# Altium schematic sheet ADC5G_DIGITALIO.SchDoc: FMC 5GS/s ADC/TDC
size 420 x 297 mm; Author: Agnieszka Bartkowicz; CompanyName: WUT ISE; DrawnBy: Agnieszka Bartkowicz; Engineer: Agnieszka Bartkowicz; Organization: WUT ISE; Address1: PW ISE; Address2: Nowowiejska 15/19 00-665 Warsaw; Address3: gyorka@o2.pl; SheetNumber: 4; SheetTotal: 13; ModifiedBy: -; CheckedDate: -; Title2: Title 2; DivGrp: WUT ISE; Designer: A. Bartkowicz
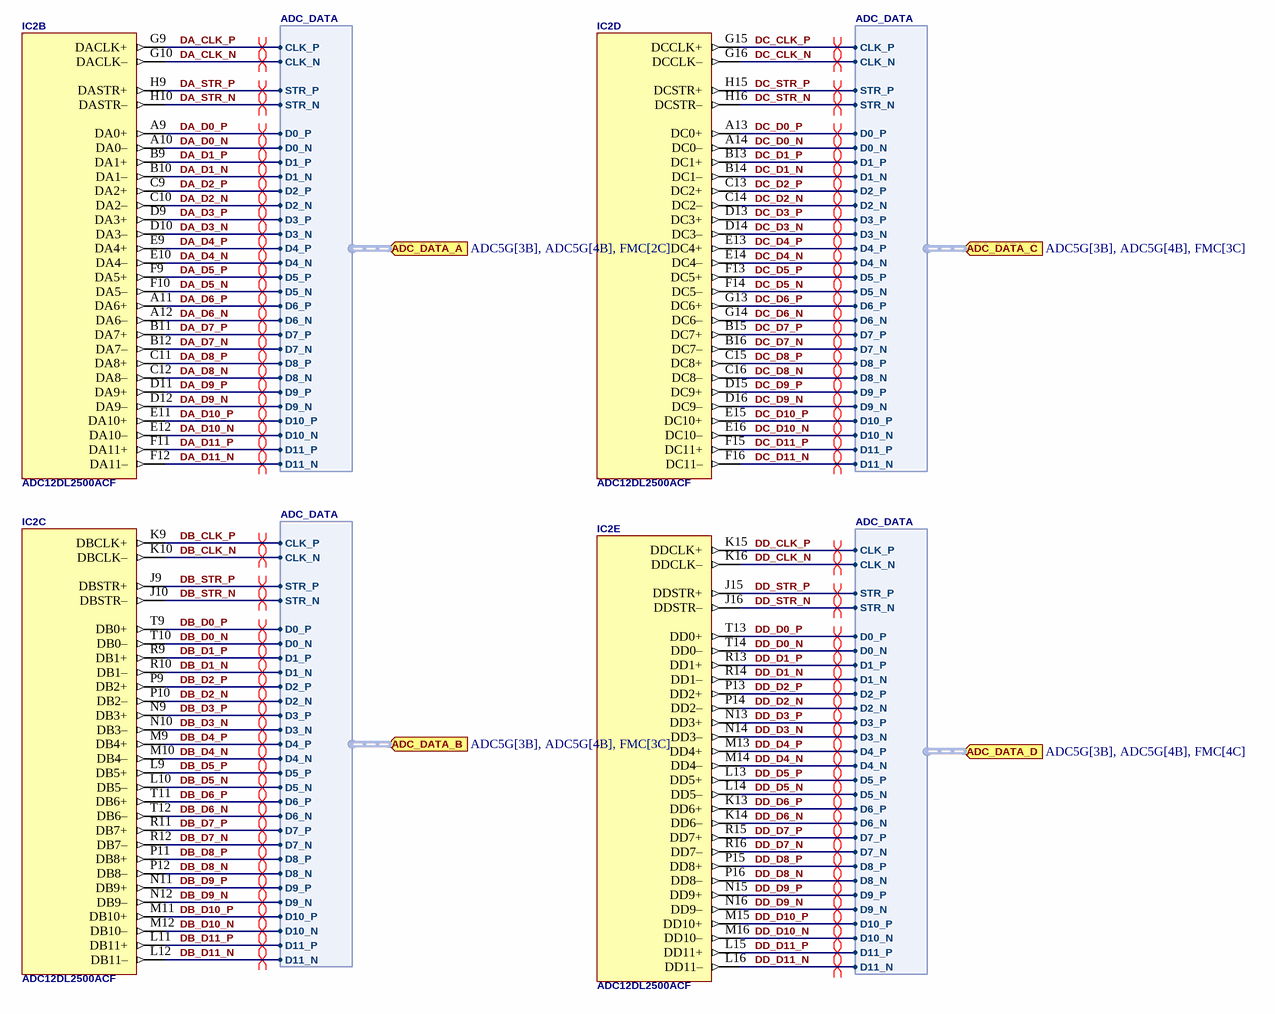
[diagram p0: ADC5G_DIGITALIO.SchDoc]

## Parts
IC2  ADC12DL2500ACF  [BGA256C100P16X16_1700X1700X331]  (parts B,C,D,E of 7)

## Ports
ADC_DATA_A (in, harness ADC_DATA, see ADC5G[3B], ADC5G[4B], FMC[2C]), ADC_DATA_B (in, harness ADC_DATA, see ADC5G[3B], ADC5G[4B], FMC[3C]), ADC_DATA_C (in, harness ADC_DATA, see ADC5G[3B], ADC5G[4B], FMC[3C]), ADC_DATA_D (in, harness ADC_DATA, see ADC5G[3B], ADC5G[4B], FMC[4C])

## Harnesses
ADC_DATA: CLK_P, CLK_N, STR_P, STR_N, D0_P, D1_P, D2_P, D3_P, D4_P, D5_P, D6_P, D7_P, D8_P, D9_P, D10_P, D11_P, D11_N, D10_N, D9_N, D8_N, D7_N, D6_N, D5_N, D4_N, D3_N, D2_N, D1_N, D0_N

## Nets
DA_CLK_N: IC2.G10(DACLK–) ; port ADC_DATA_A.CLK_N
DA_CLK_P: IC2.G9(DACLK+) ; port ADC_DATA_A.CLK_P
DA_D0_N: IC2.A10(DA0–) ; port ADC_DATA_A.D0_N
DA_D0_P: IC2.A9(DA0+) ; port ADC_DATA_A.D0_P
DA_D1_N: IC2.B10(DA1–) ; port ADC_DATA_A.D1_N
DA_D1_P: IC2.B9(DA1+) ; port ADC_DATA_A.D1_P
DA_D2_N: IC2.C10(DA2–) ; port ADC_DATA_A.D2_N
DA_D2_P: IC2.C9(DA2+) ; port ADC_DATA_A.D2_P
DA_D3_N: IC2.D10(DA3–) ; port ADC_DATA_A.D3_N
DA_D3_P: IC2.D9(DA3+) ; port ADC_DATA_A.D3_P
DA_D4_N: IC2.E10(DA4–) ; port ADC_DATA_A.D4_N
DA_D4_P: IC2.E9(DA4+) ; port ADC_DATA_A.D4_P
DA_D5_N: IC2.F10(DA5–) ; port ADC_DATA_A.D5_N
DA_D5_P: IC2.F9(DA5+) ; port ADC_DATA_A.D5_P
DA_D6_N: IC2.A12(DA6–) ; port ADC_DATA_A.D6_N
DA_D6_P: IC2.A11(DA6+) ; port ADC_DATA_A.D6_P
DA_D7_N: IC2.B12(DA7–) ; port ADC_DATA_A.D7_N
DA_D7_P: IC2.B11(DA7+) ; port ADC_DATA_A.D7_P
DA_D8_N: IC2.C12(DA8–) ; port ADC_DATA_A.D8_N
DA_D8_P: IC2.C11(DA8+) ; port ADC_DATA_A.D8_P
DA_D9_N: IC2.D12(DA9–) ; port ADC_DATA_A.D9_N
DA_D9_P: IC2.D11(DA9+) ; port ADC_DATA_A.D9_P
DA_D10_N: IC2.E12(DA10–) ; port ADC_DATA_A.D10_N
DA_D10_P: IC2.E11(DA10+) ; port ADC_DATA_A.D10_P
DA_D11_N: IC2.F12(DA11–) ; port ADC_DATA_A.D11_N
DA_D11_P: IC2.F11(DA11+) ; port ADC_DATA_A.D11_P
DA_STR_N: IC2.H10(DASTR–) ; port ADC_DATA_A.STR_N
DA_STR_P: IC2.H9(DASTR+) ; port ADC_DATA_A.STR_P
DB_CLK_N: IC2.K10(DBCLK–) ; port ADC_DATA_B.CLK_N
DB_CLK_P: IC2.K9(DBCLK+) ; port ADC_DATA_B.CLK_P
DB_D0_N: IC2.T10(DB0–) ; port ADC_DATA_B.D0_N
DB_D0_P: IC2.T9(DB0+) ; port ADC_DATA_B.D0_P
DB_D1_N: IC2.R10(DB1–) ; port ADC_DATA_B.D1_N
DB_D1_P: IC2.R9(DB1+) ; port ADC_DATA_B.D1_P
DB_D2_N: IC2.P10(DB2–) ; port ADC_DATA_B.D2_N
DB_D2_P: IC2.P9(DB2+) ; port ADC_DATA_B.D2_P
DB_D3_N: IC2.N10(DB3–) ; port ADC_DATA_B.D3_N
DB_D3_P: IC2.N9(DB3+) ; port ADC_DATA_B.D3_P
DB_D4_N: IC2.M10(DB4–) ; port ADC_DATA_B.D4_N
DB_D4_P: IC2.M9(DB4+) ; port ADC_DATA_B.D4_P
DB_D5_N: IC2.L10(DB5–) ; port ADC_DATA_B.D5_N
DB_D5_P: IC2.L9(DB5+) ; port ADC_DATA_B.D5_P
DB_D6_N: IC2.T12(DB6–) ; port ADC_DATA_B.D6_N
DB_D6_P: IC2.T11(DB6+) ; port ADC_DATA_B.D6_P
DB_D7_N: IC2.R12(DB7–) ; port ADC_DATA_B.D7_N
DB_D7_P: IC2.R11(DB7+) ; port ADC_DATA_B.D7_P
DB_D8_N: IC2.P12(DB8–) ; port ADC_DATA_B.D8_N
DB_D8_P: IC2.P11(DB8+) ; port ADC_DATA_B.D8_P
DB_D9_N: IC2.N12(DB9–) ; port ADC_DATA_B.D9_N
DB_D9_P: IC2.N11(DB9+) ; port ADC_DATA_B.D9_P
DB_D10_N: IC2.M12(DB10–) ; port ADC_DATA_B.D10_N
DB_D10_P: IC2.M11(DB10+) ; port ADC_DATA_B.D10_P
DB_D11_N: IC2.L12(DB11–) ; port ADC_DATA_B.D11_N
DB_D11_P: IC2.L11(DB11+) ; port ADC_DATA_B.D11_P
DB_STR_N: IC2.J10(DBSTR–) ; port ADC_DATA_B.STR_N
DB_STR_P: IC2.J9(DBSTR+) ; port ADC_DATA_B.STR_P
DC_CLK_N: IC2.G16(DCCLK–) ; port ADC_DATA_C.CLK_N
DC_CLK_P: IC2.G15(DCCLK+) ; port ADC_DATA_C.CLK_P
DC_D0_N: IC2.A14(DC0–) ; port ADC_DATA_C.D0_N
DC_D0_P: IC2.A13(DC0+) ; port ADC_DATA_C.D0_P
DC_D1_N: IC2.B14(DC1–) ; port ADC_DATA_C.D1_N
DC_D1_P: IC2.B13(DC1+) ; port ADC_DATA_C.D1_P
DC_D2_N: IC2.C14(DC2–) ; port ADC_DATA_C.D2_N
DC_D2_P: IC2.C13(DC2+) ; port ADC_DATA_C.D2_P
DC_D3_N: IC2.D14(DC3–) ; port ADC_DATA_C.D3_N
DC_D3_P: IC2.D13(DC3+) ; port ADC_DATA_C.D3_P
DC_D4_N: IC2.E14(DC4–) ; port ADC_DATA_C.D4_N
DC_D4_P: IC2.E13(DC4+) ; port ADC_DATA_C.D4_P
DC_D5_N: IC2.F14(DC5–) ; port ADC_DATA_C.D5_N
DC_D5_P: IC2.F13(DC5+) ; port ADC_DATA_C.D5_P
DC_D6_N: IC2.G14(DC6–) ; port ADC_DATA_C.D6_N
DC_D6_P: IC2.G13(DC6+) ; port ADC_DATA_C.D6_P
DC_D7_N: IC2.B16(DC7–) ; port ADC_DATA_C.D7_N
DC_D7_P: IC2.B15(DC7+) ; port ADC_DATA_C.D7_P
DC_D8_N: IC2.C16(DC8–) ; port ADC_DATA_C.D8_N
DC_D8_P: IC2.C15(DC8+) ; port ADC_DATA_C.D8_P
DC_D9_N: IC2.D16(DC9–) ; port ADC_DATA_C.D9_N
DC_D9_P: IC2.D15(DC9+) ; port ADC_DATA_C.D9_P
DC_D10_N: IC2.E16(DC10–) ; port ADC_DATA_C.D10_N
DC_D10_P: IC2.E15(DC10+) ; port ADC_DATA_C.D10_P
DC_D11_N: IC2.F16(DC11–) ; port ADC_DATA_C.D11_N
DC_D11_P: IC2.F15(DC11+) ; port ADC_DATA_C.D11_P
DC_STR_N: IC2.H16(DCSTR–) ; port ADC_DATA_C.STR_N
DC_STR_P: IC2.H15(DCSTR+) ; port ADC_DATA_C.STR_P
DD_CLK_N: IC2.K16(DDCLK–) ; port ADC_DATA_D.CLK_N
DD_CLK_P: IC2.K15(DDCLK+) ; port ADC_DATA_D.CLK_P
DD_D0_N: IC2.T14(DD0–) ; port ADC_DATA_D.D0_N
DD_D0_P: IC2.T13(DD0+) ; port ADC_DATA_D.D0_P
DD_D1_N: IC2.R14(DD1–) ; port ADC_DATA_D.D1_N
DD_D1_P: IC2.R13(DD1+) ; port ADC_DATA_D.D1_P
DD_D2_N: IC2.P14(DD2–) ; port ADC_DATA_D.D2_N
DD_D2_P: IC2.P13(DD2+) ; port ADC_DATA_D.D2_P
DD_D3_N: IC2.N14(DD3–) ; port ADC_DATA_D.D3_N
DD_D3_P: IC2.N13(DD3+) ; port ADC_DATA_D.D3_P
DD_D4_N: IC2.M14(DD4–) ; port ADC_DATA_D.D4_N
DD_D4_P: IC2.M13(DD4+) ; port ADC_DATA_D.D4_P
DD_D5_N: IC2.L14(DD5–) ; port ADC_DATA_D.D5_N
DD_D5_P: IC2.L13(DD5+) ; port ADC_DATA_D.D5_P
DD_D6_N: IC2.K14(DD6–) ; port ADC_DATA_D.D6_N
DD_D6_P: IC2.K13(DD6+) ; port ADC_DATA_D.D6_P
DD_D7_N: IC2.R16(DD7–) ; port ADC_DATA_D.D7_N
DD_D7_P: IC2.R15(DD7+) ; port ADC_DATA_D.D7_P
DD_D8_N: IC2.P16(DD8–) ; port ADC_DATA_D.D8_N
DD_D8_P: IC2.P15(DD8+) ; port ADC_DATA_D.D8_P
DD_D9_N: IC2.N16(DD9–) ; port ADC_DATA_D.D9_N
DD_D9_P: IC2.N15(DD9+) ; port ADC_DATA_D.D9_P
DD_D10_N: IC2.M16(DD10–) ; port ADC_DATA_D.D10_N
DD_D10_P: IC2.M15(DD10+) ; port ADC_DATA_D.D10_P
DD_D11_N: IC2.L16(DD11–) ; port ADC_DATA_D.D11_N
DD_D11_P: IC2.L15(DD11+) ; port ADC_DATA_D.D11_P
DD_STR_N: IC2.J16(DDSTR–) ; port ADC_DATA_D.STR_N
DD_STR_P: IC2.J15(DDSTR+) ; port ADC_DATA_D.STR_P

## Layout directives
differential pair: DA_CLK_N, DA_CLK_P, DA_D0_N, DA_D0_P, DA_D1_N, DA_D1_P, DA_D2_N, DA_D2_P, DA_D3_N, DA_D3_P, DA_D4_N, DA_D4_P, DA_D5_N, DA_D5_P, DA_D6_N, DA_D6_P, DA_D7_N, DA_D7_P, DA_D8_N, DA_D8_P, DA_D9_N, DA_D9_P, DA_D10_N, DA_D10_P, DA_D11_N, DA_D11_P, DA_STR_N, DA_STR_P, DB_CLK_N, DB_CLK_P, DB_D0_N, DB_D0_P, DB_D1_N, DB_D1_P, DB_D2_N, DB_D2_P, DB_D3_N, DB_D3_P, DB_D4_N, DB_D4_P, DB_D5_N, DB_D5_P, DB_D6_N, DB_D6_P, DB_D7_N, DB_D7_P, DB_D8_N, DB_D8_P, DB_D9_N, DB_D9_P, DB_D10_N, DB_D10_P, DB_D11_N, DB_D11_P, DB_STR_N, DB_STR_P, DC_CLK_N, DC_CLK_P, DC_D0_N, DC_D0_P, DC_D1_N, DC_D1_P, DC_D2_N, DC_D2_P, DC_D3_N, DC_D3_P, DC_D4_N, DC_D4_P, DC_D5_N, DC_D5_P, DC_D6_N, DC_D6_P, DC_D7_N, DC_D7_P, DC_D8_N, DC_D8_P, DC_D9_N, DC_D9_P, DC_D10_N, DC_D10_P, DC_D11_N, DC_D11_P, DC_STR_N, DC_STR_P, DD_CLK_N, DD_CLK_P, DD_D0_N, DD_D0_P, DD_D1_N, DD_D1_P, DD_D2_N, DD_D2_P, DD_D3_N, DD_D3_P, DD_D4_N, DD_D4_P, DD_D5_N, DD_D5_P, DD_D6_N, DD_D6_P, DD_D7_N, DD_D7_P, DD_D8_N, DD_D8_P, DD_D9_N, DD_D9_P, DD_D10_N, DD_D10_P, DD_D11_N, DD_D11_P, DD_STR_N, DD_STR_P

## Notes on the sheet
- Project/Equipment
- Document
- Designer
- Drawn by
- Check.by
- Copyright WUT ISE 2024.
  This documentation describes Open Hardware and is licensed under the CERN OHL v.2. You may redistribute and modify this documentation under the terms of the CERN OHL v.2. (http://ohwr.org/CERNOHL). This documentation is distributed WITHOUT ANY EXPRESS OR IMPLIED WARRANTY, INCLUDING OF MERCHANTABILITY, SATISFACTORY QUALITY AND FITNESS FOR A PARTICULAR PURPOSE. Please see the CERN OHL v.2 for applicable conditions.
- Contact
- File
- Last Mod.
- Print Date
- Sheet
- Size
- A3
- of
- Rev

## Library data of the parts
IC2 = ADC12DL2500ACF: Single-Supply, Multichannel, 125kSPS, 24-Bit, Sigma-Delta ADC with ±10V Inputs; Part Description: 1.5 GSPS Dual-Channel or 1, 3, 5GSPS Single-Channel,12-Bit Analog-to-Digital Converters (ADC) With LVDS Interface; Manufacturer: TEXAS INSTRUMENTS; PressFit: No; Bonding: No; Part Number: ADC12DL2500ACF; Component Kind: Standard; Component Type: Standard; Device: ADC12DL2500ACF; PackageDescription: BGA, 1.00mm Pitch, Square; 156 Pin, 16 Columns X 16 Rows, 17.0mm X 17.0mm X 3.31mm H body, IPC Medium Density; Manufacturer Part Number: ADC12DL2500ACF; Pin Count: 256; Case: BGA256; Mounted: Yes; Socket: No; SMD: Yes; Sense: No; ComponentHeight: 3.31mm; Author: CERN DEM HF; HelpURL: \\cern.ch\dfs\Applications\Altium\Datasheets\ADC12DLX500ACF.pdf; CreateDate: 04.12.2024; LatestRevisionDate: 04.12.2024